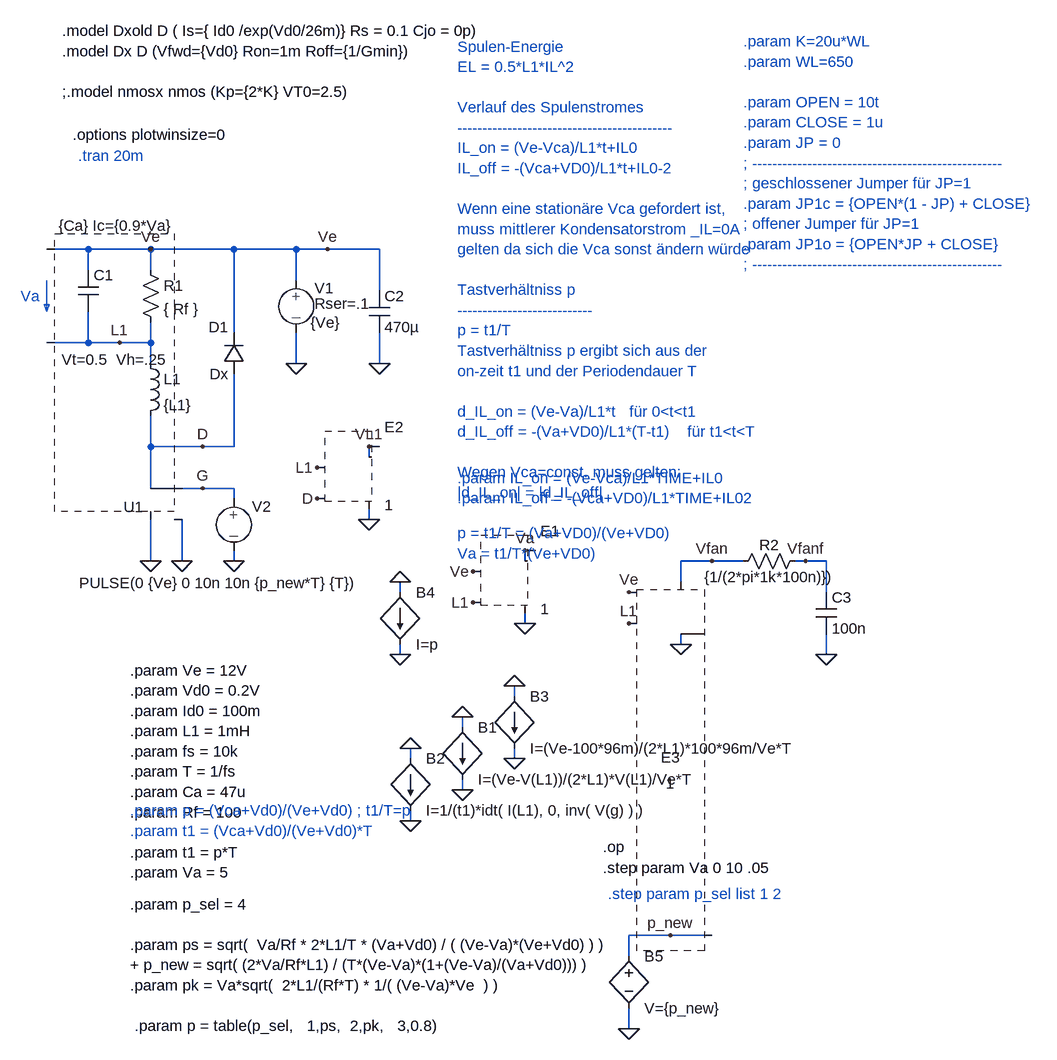
[diagram p0: schematic ws13_14_buck_fan_p_as_func.asc]
ws13_14_buck_fan_p_as_func.asc, the LTspice schematic file:
Version 4
SHEET 1 2468 1060
WIRE -96 -368 -160 -368
WIRE 0 -368 -96 -368
WIRE 128 -368 0 -368
WIRE 224 -368 128 -368
WIRE 272 -368 224 -368
WIRE 352 -368 272 -368
WIRE -96 -336 -96 -368
WIRE 0 -336 0 -368
WIRE 224 -320 224 -368
WIRE 352 -304 352 -368
WIRE 128 -240 128 -368
WIRE -96 -224 -96 -272
WIRE -96 -224 -160 -224
WIRE -48 -224 -96 -224
WIRE 0 -224 0 -256
WIRE 0 -224 -48 -224
WIRE 0 -192 0 -224
WIRE 224 -192 224 -240
WIRE 352 -192 352 -240
WIRE 0 -64 0 -112
WIRE 80 -64 0 -64
WIRE 128 -64 128 -176
WIRE 128 -64 80 -64
WIRE 352 -64 336 -64
WIRE 336 -48 336 -64
WIRE 0 0 0 -64
WIRE 80 0 48 0
WIRE 128 0 80 0
WIRE 128 16 128 0
WIRE 336 48 336 32
WIRE 592 96 576 96
WIRE 0 112 0 48
WIRE 48 112 48 48
WIRE 128 112 128 96
WIRE 576 112 576 96
WIRE 864 112 816 112
WIRE 912 112 864 112
WIRE 1008 112 992 112
WIRE 1040 112 1008 112
WIRE 816 144 816 112
WIRE 384 160 384 144
WIRE 1040 160 1040 112
WIRE 576 208 576 192
WIRE 816 240 816 224
WIRE 384 256 384 240
WIRE 1040 256 1040 224
WIRE 560 320 560 304
WIRE 480 368 480 352
WIRE 400 416 400 400
WIRE 560 416 560 400
WIRE 480 464 480 448
WIRE 400 512 400 496
WIRE 800 688 736 688
WIRE 864 688 800 688
WIRE 736 720 736 688
WIRE 736 832 736 800
FLAG 0 112 0
FLAG 224 -192 0
FLAG 128 112 0
FLAG 0 -368 Ve
FLAG -48 -224 L1
FLAG 48 112 0
FLAG 80 0 G
FLAG 80 -64 D
FLAG 352 -192 0
FLAG 400 512 0
FLAG 336 48 0
FLAG 336 -64 VL1
FLAG 256 -32 L1
FLAG 256 16 D
FLAG 480 464 0
FLAG 480 352 0
FLAG 400 400 0
FLAG 560 416 0
FLAG 560 304 0
FLAG 272 -368 Ve
FLAG 384 256 0
FLAG 384 144 0
FLAG 576 208 0
FLAG 576 96 Va
FLAG 496 128 Ve
FLAG 496 176 L1
FLAG 816 240 0
FLAG 736 160 Ve
FLAG 736 208 L1
FLAG 864 112 Vfan
FLAG 1040 256 0
FLAG 1008 112 Vfanf
FLAG 736 832 0
FLAG 800 688 p_new
SYMBOL source-V 224 -336 R0
WINDOW 123 0 0 Left 2
WINDOW 39 28 52 Left 2
WINDOW 3 22 81 Left 2
SYMATTR SpiceLine Rser=.1
SYMATTR Value {Ve}
SYMATTR InstName V1
SYMBOL diode 144 -176 R180
WINDOW 0 24 72 Left 2
WINDOW 3 24 0 Left 2
SYMATTR InstName D1
SYMATTR Value Dx
SYMBOL ind -16 -208 R0
SYMATTR InstName L1
SYMATTR Value {L1}
SYMBOL res -16 -352 R0
SYMATTR InstName R1
SYMATTR Value { Rf }
SYMBOL cap -112 -336 R0
WINDOW 3 -30 -68 Left 2
SYMATTR Value {Ca} Ic={0.9*Va}
SYMATTR InstName C1
SYMBOL source-V 128 0 R0
WINDOW 3 -238 146 Left 2
WINDOW 123 0 0 Left 2
WINDOW 39 0 0 Left 2
SYMATTR Value PULSE(0 {Ve} 0 10n 10n {p_new*T} {T})
SYMATTR InstName V2
SYMBOL cap 336 -304 R0
SYMATTR InstName C2
SYMATTR Value 470µ
SYMBOL bi 400 416 R0
SYMATTR InstName B2
SYMATTR Value I=1/(t1)*idt( I(L1), 0, inv( V(g) ) )
SYMBOL crtl-V-V 336 -64 R0
SYMATTR InstName E2
SYMATTR Value 1
SYMBOL MDB_sym\\swMDB 16 32 R180
WINDOW 0 27 3 Left 2
SYMATTR InstName U1
SYMATTR Value Vt=0.5  Vh=.25
SYMATTR Value2 Lser=0n  Vser=.1 ron=1m roff=10meg
SYMBOL bi 480 368 R0
SYMATTR InstName B1
SYMATTR Value I=(Ve-V(L1))/(2*L1)*V(L1)/Ve*T
SYMBOL bi 560 320 R0
SYMATTR InstName B3
SYMATTR Value I=(Ve-100*96m)/(2*L1)*100*96m/Ve*T
SYMBOL bi 384 160 R0
SYMATTR InstName B4
SYMATTR Value I=p
SYMBOL crtl-V-V 576 96 R0
SYMATTR InstName E1
SYMATTR Value 1
SYMBOL crtl-V-V 816 128 R0
SYMATTR InstName E3
SYMATTR Value 1
SYMBOL res 896 128 R270
WINDOW 0 25 56 VTop 2
WINDOW 3 7 56 VBottom 2
SYMATTR InstName R2
SYMATTR Value {1/(2*pi*1k*100n)})
SYMBOL cap 1024 160 R0
SYMATTR InstName C3
SYMATTR Value 100n
SYMBOL bv 736 704 R0
SYMATTR InstName B5
SYMATTR Value V={p_new}
TEXT -32 280 Left 2 !.param Ve = 12V  \n.param Vd0 = 0.2V  \n.param Id0 = 100m\n.param L1 = 1mH \n.param fs = 10k\n.param T = 1/fs  \n.param Ca = 47u  \n.param Rf = 100
TEXT 912 -688 Left 2 ;.param K=20u*WL\n.param WL=650\n \n.param OPEN = 10t\n.param CLOSE = 1u\n.param JP = 0\n; --------------------------------------------------\n; geschlossener Jumper für JP=1\n.param JP1c = {OPEN*(1 - JP) + CLOSE} \n; offener Jumper für JP=1  \n.param JP1o = {OPEN*JP + CLOSE}\n; --------------------------------------------------
TEXT 472 -680 Left 2 ;Spulen-Energie \nEL = 0.5*L1*IL^2\n \nVerlauf des Spulenstromes\n-------------------------------------------\nIL_on = (Ve-Vca)/L1*t+IL0\nIL_off = -(Vca+VD0)/L1*t+IL0-2\n \nWenn eine stationäre Vca gefordert ist,\nmuss mittlerer Kondensatorstrom _IL=0A\ngelten da sich die Vca sonst ändern würde\n \nTastverhältniss p\n---------------------------\np = t1/T  \nTastverhältniss p ergibt sich aus der \non-zeit t1 und der Periodendauer T\n \nd_IL_on = (Ve-Va)/L1*t   für 0<t<t1\nd_IL_off = -(Va+VD0)/L1*(T-t1)    für t1<t<T\n \nWegen Vca=const. muss gelten:\n|d_IL_on| = |d_IL_off|\n \np = t1/T = (Va+VD0)/(Ve+VD0)\nVa = t1/T*(Ve+VD0)
TEXT 472 -16 Left 2 ;.param IL_on = (Ve-Vca)/L1*TIME+IL0\n.param IL_off = -(Vca+VD0)/L1*TIME+IL02
TEXT -120 -544 Left 2 !.options plotwinsize=0
TEXT -200 -296 Left 2 ;Va
TEXT -112 -512 Left 2 ;.tran 20m
TEXT -32 560 Left 2 !.param t1 = p*T\n.param Va = 5
TEXT -32 496 Left 2 ;.param p = (Vca+Vd0)/(Ve+Vd0) ; t1/T=p\n.param t1 = (Vca+Vd0)/(Ve+Vd0)*T
TEXT -136 -704 Left 2 !.model Dxold D ( Is={ Id0 /exp(Vd0/26m)} Rs = 0.1 Cjo = 0p)\n.model Dx D (Vfwd={Vd0} Ron=1m Roff={1/Gmin})\n \n;.model nmosx nmos (Kp={2*K} VT0=2.5)
TEXT -32 640 Left 2 !.param p_sel = 4\n \n.param ps = sqrt(  Va/Rf * 2*L1/T * (Va+Vd0) / ( (Ve-Va)*(Ve+Vd0) ) )\n+ p_new = sqrt( (2*Va/Rf*L1) / (T*(Ve-Va)*(1+(Ve-Va)/(Va+Vd0))) )\n.param pk = Va*sqrt(  2*L1/(Rf*T) * 1/( (Ve-Va)*Ve  ) )\n \n .param p = table(p_sel,   1,ps,  2,pk,   3,0.8)
TEXT 704 624 Left 2 ;.step param p_sel list 1 2
TEXT 696 584 Left 2 !.step param Va 0 10 .05
TEXT 696 552 Left 2 !.op
LINE Normal -160 -272 -160 -320
LINE Normal -164 -283 -160 -272
LINE Normal -156 -283 -164 -283
LINE Normal -156 -283 -160 -272

The netlist it stands for:
* ws13_14_buck_fan_p_as_func.asc
V1 Ve 0 {Ve} Rser=.1
D1 D Ve Dx
L1 L1 D {L1}
R1 Ve L1 { Rf }
C1 Ve L1 {Ca} Ic={0.9*Va}
V2 G 0 PULSE(0 {Ve} 0 10n 10n {p_new*T} {T})
C2 Ve 0 470µ
B2 0 0 I=1/(t1)*idt( I(L1), 0, inv( V(g) ) )
* E2: 1 (symbol crtl-V-V not available, pin order unknown); nets seen at it: 0, D, L1, VL1
* U1: Vt=0.5  Vh=.25 Lser=0n  Vser=.1 ron=1m roff=10meg (symbol MDB_sym\swMDB not available, pin order unknown); nets seen at it: 0, D, G, L1, Ve
B1 0 0 I=(Ve-V(L1))/(2*L1)*V(L1)/Ve*T
B3 0 0 I=(Ve-100*96m)/(2*L1)*100*96m/Ve*T
B4 0 0 I=p
* E1: 1 (symbol crtl-V-V not available, pin order unknown); nets seen at it: 0, L1, Va, Ve
* E3: 1 (symbol crtl-V-V not available, pin order unknown); nets seen at it: 0, L1, p_new, Ve, Vfan
R2 Vfan Vfanf {1/(2*pi*1k*100n)})
C3 Vfanf 0 100n
B5 p_new 0 V={p_new}
.model D D
.lib standard.dio
.param Ve = 12V
.param Vd0 = 0.2V
.param Id0 = 100m
.param L1 = 1mH
.param fs = 10k
.param T = 1/fs
.param Ca = 47u
.param Rf = 100
* .param K=20u*WL
* .param WL=650
* .param OPEN = 10t
* .param CLOSE = 1u
* .param JP = 0
* ; --------------------------------------------------
* ; geschlossener Jumper für JP=1
* .param JP1c = {OPEN*(1 - JP) + CLOSE}
* ; offener Jumper für JP=1
* .param JP1o = {OPEN*JP + CLOSE}
* ; --------------------------------------------------
* Spulen-Energie
* EL = 0.5*L1*IL^2
* Verlauf des Spulenstromes
* -------------------------------------------
* IL_on = (Ve-Vca)/L1*t+IL0
* IL_off = -(Vca+VD0)/L1*t+IL0-2
* Wenn eine stationäre Vca gefordert ist,
* muss mittlerer Kondensatorstrom _IL=0A
* gelten da sich die Vca sonst ändern würde
* Tastverhältniss p
* ---------------------------
* p = t1/T
* Tastverhältniss p ergibt sich aus der
* on-zeit t1 und der Periodendauer T
* d_IL_on = (Ve-Va)/L1*t   für 0<t<t1
* d_IL_off = -(Va+VD0)/L1*(T-t1)    für t1<t<T
* Wegen Vca=const. muss gelten:
* |d_IL_on| = |d_IL_off|
* p = t1/T = (Va+VD0)/(Ve+VD0)
* Va = t1/T*(Ve+VD0)
* .param IL_on = (Ve-Vca)/L1*TIME+IL0
* .param IL_off = -(Vca+VD0)/L1*TIME+IL02
.options plotwinsize=0
* Va
* .tran 20m
.param t1 = p*T
.param Va = 5
* .param p = (Vca+Vd0)/(Ve+Vd0) ; t1/T=p
* .param t1 = (Vca+Vd0)/(Ve+Vd0)*T
.model Dxold D ( Is={ Id0 /exp(Vd0/26m)} Rs = 0.1 Cjo = 0p)
.model Dx D (Vfwd={Vd0} Ron=1m Roff={1/Gmin})
;.model nmosx nmos (Kp={2*K} VT0=2.5)
.param p_sel = 4
.param ps = sqrt(  Va/Rf * 2*L1/T * (Va+Vd0) / ( (Ve-Va)*(Ve+Vd0) ) )
+ p_new = sqrt( (2*Va/Rf*L1) / (T*(Ve-Va)*(1+(Ve-Va)/(Va+Vd0))) )
.param pk = Va*sqrt(  2*L1/(Rf*T) * 1/( (Ve-Va)*Ve  ) )
 .param p = table(p_sel,   1,ps,  2,pk,   3,0.8)
* .step param p_sel list 1 2
.step param Va 0 10 .05
.op
.backanno
.end